# Altium schematic sheet BrakeLines.SchDoc
size A; SheetNumber: 2; SheetTotal: 10
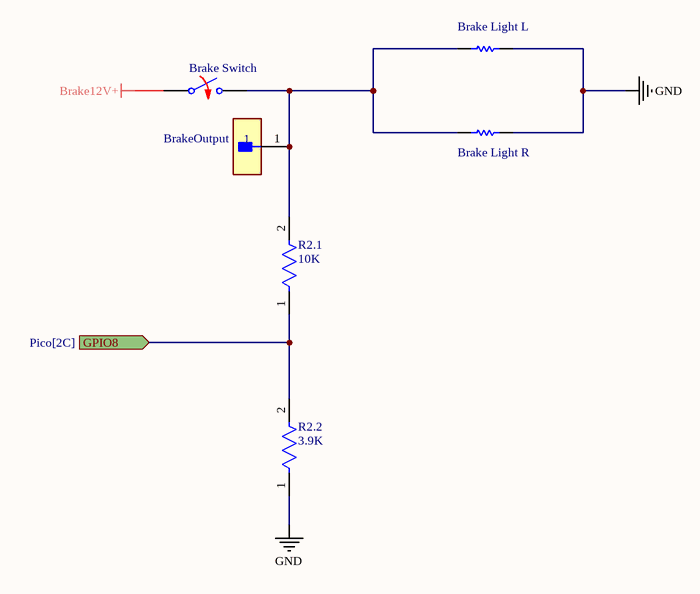
[diagram p0: BrakeLines.SchDoc]

## Parts
Brake_Light_L  Resistor  (value not drawn)
Brake_Light_R  Resistor  (value not drawn)
Brake_Switch  Brake Switch  (value not drawn)
BrakeOutput  TSW-101-07-L-S  [FP-TSW-101-07-L-S-MFG]  (value not drawn)
R2.1  10K  [FP-MFR-12-MFG]
R2.2  3.9K  [FP-MFR-12-MFG]

## Ports
GPIO8 (in, see Pico[2C])

## Nets
Brake12V+: Brake_Switch.1
GND: Brake_Light_L.2 Brake_Light_R.2 R2.2.1
GPIO8: R2.1.1 R2.2.2 ; port GPIO8
NetBrake_Light_L_1: Brake_Light_L.1 Brake_Light_R.1 Brake_Switch.2 BrakeOutput.1 R2.1.2

## Library data of the parts
Brake_Light_L Brake_Light_R = Resistor: TC1: 0; SimulationGenericComponent: True; Value: 1K; TC2: 0
Brake_Switch = SW NO: Switch Normally Opened; closed: 0; Rclosed: 1m; Ropen: 1Meg; SimulationGenericComponent: True
BrakeOutput = CMP-02766-001775-1: CONN HEADER VERT 1POS; Gender: Male; Number of Contacts: 1; Max Current Rating: 7.6A; Max Voltage Rating (AC): 550V; RoHS Compliant: Yes; Contact Finish - Mating: GOLD; Length: 2.54mm; Series: TSW; Insulation Material: PBT; Reach SVHC Compliant: Yes; Radiation Hardening: No; Contact Plating: Gold; Termination: Solder; Contact Type: Male Pin; Orientation: Straight; Number of Rows: 1; Depth: 2.54mm; Housing Material: Polyester; Lead Free: Lead Free; Fastening Type: Pull; Flammability Rating: UL94 V-0; Mount: Through Hole; Housing Color: Black; Contact Shape: Square; Min Operating Temperature: -55°C; Connector Type: Header; Contact Mating Length: 0.23inch; Width: 2.54mm; Packaging: Bulk; Contact Material: Bronze; Max Operating Temperature: 125°C; Number of Positions: 1; Color: Black; Insulation Color: Black
R2.1 R2.2 = CMP-03413-000012-1: RES MF 1/6W 1% AXIAL; Power Rating: 160mW; Voltage Rating (DC): 200V; Resistance: 10kR; Min Operating Temperature: -55°C; Max Operating Temperature: 155°C; Voltage Rating: 200V; Termination: Axial; Packaging: Ammo Pack; Tolerance: 1%